# EAGLE design mb (EAGLE 9.5.2)

## Sheet 1 of 4: Controller
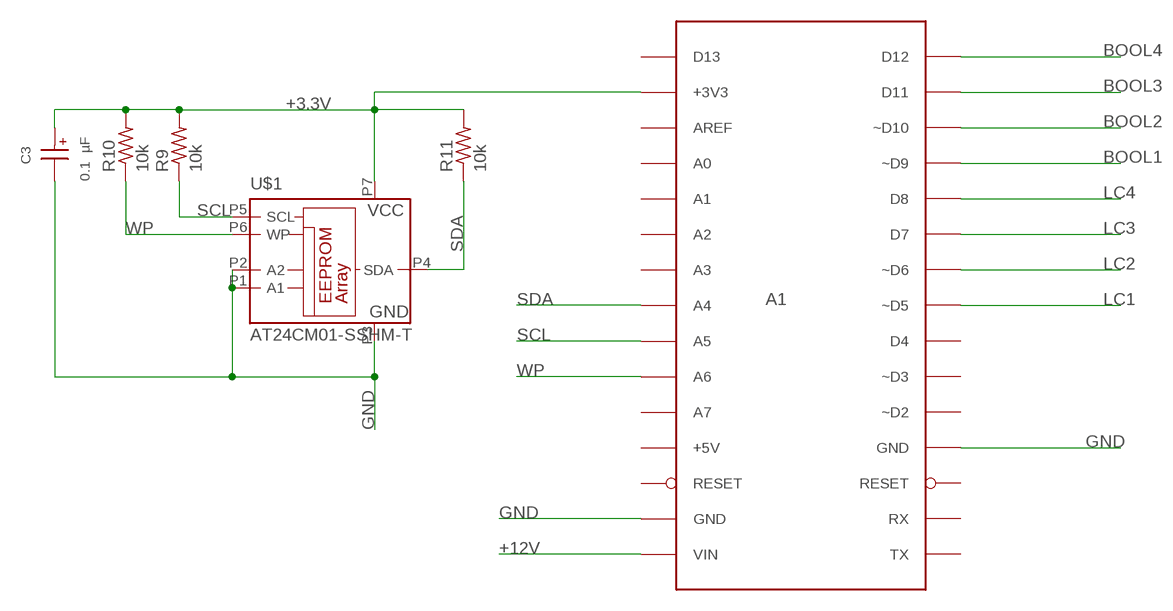
[diagram p0: schematic, sheet 1]

### Parts
A1  NANO_33_IOTNANO_EVERY_SMD  [NANO_EVERY_SMD_PADS]
C3  0.1 µF  WCAP-ATG5_5X11_860020672001  [WCAP-ATG5_5X11(DXL)]
R9  10k  YAGEO-CFR-25  [CFR-25]
R10  10k  YAGEO-CFR-25  [CFR-25]
R11  10k  YAGEO-CFR-25  [CFR-25]
U$1  AT24CM01-SSHM-T  [8-SOIC(3.9MM)]

### Nets
+3.3V: A1.+3.3V(+3V3) C3.1(+) R9.P$2 R10.P$2 R11.P$2 U$1.P7(VCC) ; also sheet 3,4
+12V [POWER]: A1.VIN ; also sheet 2,4
BOOL1: A1.D9(~D9) ; also sheet 4
BOOL2: A1.D10(~D10) ; also sheet 4
BOOL3: A1.D11 ; also sheet 4
BOOL4: A1.D12 ; also sheet 4
GND: A1.GND@1(GND) A1.GND@2(GND) C3.2(-) U$1.P1(A1) U$1.P2(A2) U$1.P3(GND) ; also sheet 2,4
LC1: A1.D5(~D5) ; also sheet 3
LC2: A1.D6(~D6) ; also sheet 3
LC3: A1.D7 ; also sheet 3
LC4: A1.D8 ; also sheet 3
SCL: A1.A5 R9.P$1 U$1.P5(SCL) ; also sheet 4
SDA: A1.A4 R11.P$1 U$1.P4(SDA) ; also sheet 4
WP: A1.A6 R10.P$1 U$1.P6(WP)
Unconnected: A1.+5V A1.A0 A1.A1 A1.A2 A1.A3 A1.A7 A1.AREF A1.D2(~D2) A1.D3(~D3) A1.D4 A1.D13 A1.RESET@1(RESET) A1.RESET@2(RESET) A1.RX A1.TX

## Sheet 2 of 4: Power
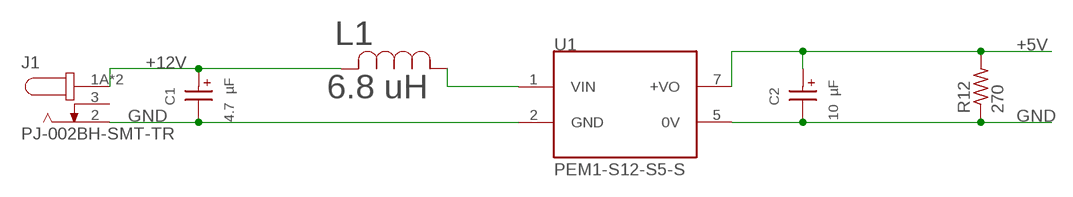
[diagram p1: schematic, sheet 2]

### Parts
C1  4.7 µF  WCAP-ATG5_5X11_860020672008  [WCAP-ATG5_5X11(DXL)]
C2  10 µF  WCAP-ATG5_5X11_860020672010  [WCAP-ATG5_5X11(DXL)]
J1  PJ-002BH-SMT-TR  [CUI_PJ-002BH-SMT-TR]
L1  6.8 uH  RL622-6R8K-RC  [RL622_SERIES]
R12  270  YAGEO-CFR-25  [CFR-25]
U1  PEM1-S12-S5-S  [CONV_PEM1-S12-S5-S]

### Nets
+5V: C2.1(+) R12.P$2 U1.7(+VO) ; also sheet 3
+12V [POWER]: C1.1(+) J1.1A J1.1B L1.2 ; also sheet 1,4
GND: C1.2(-) C2.2(-) J1.2 R12.P$1 U1.2(GND) U1.5(0V) ; also sheet 1,4
N$1: L1.1 U1.1(VIN)
Unconnected: J1.3

## Sheet 3 of 4: Level Shifter
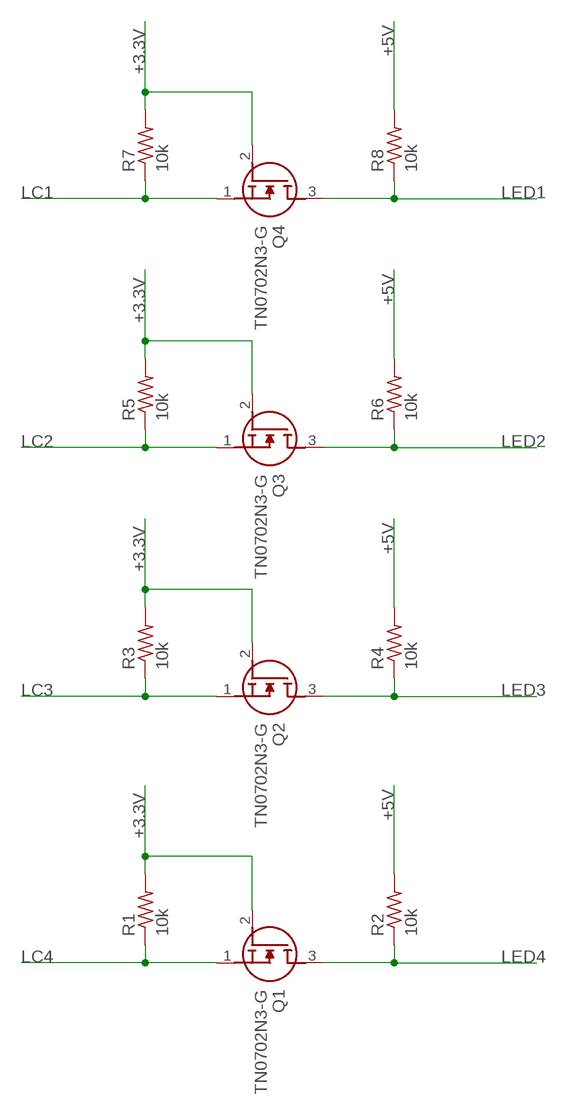
[diagram p2: schematic, sheet 3]

### Parts
Q1  TN0702N3-G  [LND150N3-G]
Q2  TN0702N3-G  [LND150N3-G]
Q3  TN0702N3-G  [LND150N3-G]
Q4  TN0702N3-G  [LND150N3-G]
R1  10k  YAGEO-CFR-25  [CFR-25]
R2  10k  YAGEO-CFR-25  [CFR-25]
R3  10k  YAGEO-CFR-25  [CFR-25]
R4  10k  YAGEO-CFR-25  [CFR-25]
R5  10k  YAGEO-CFR-25  [CFR-25]
R6  10k  YAGEO-CFR-25  [CFR-25]
R7  10k  YAGEO-CFR-25  [CFR-25]
R8  10k  YAGEO-CFR-25  [CFR-25]

### Nets
+3.3V: Q1.2(G) Q2.2(G) Q3.2(G) Q4.2(G) R1.P$2 R3.P$2 R5.P$2 R7.P$2 ; also sheet 1,4
+5V: R2.P$2 R4.P$2 R6.P$2 R8.P$2 ; also sheet 2
LC1: Q4.1(S) R7.P$1 ; also sheet 1
LC2: Q3.1(S) R5.P$1 ; also sheet 1
LC3: Q2.1(S) R3.P$1 ; also sheet 1
LC4: Q1.1(S) R1.P$1 ; also sheet 1
LED1: Q4.3(D) R8.P$1 ; also sheet 4
LED2: Q3.3(D) R6.P$1 ; also sheet 4
LED3: Q2.3(D) R4.P$1 ; also sheet 4
LED4: Q1.3(D) R2.P$1 ; also sheet 4

## Sheet 4 of 4: Connectors
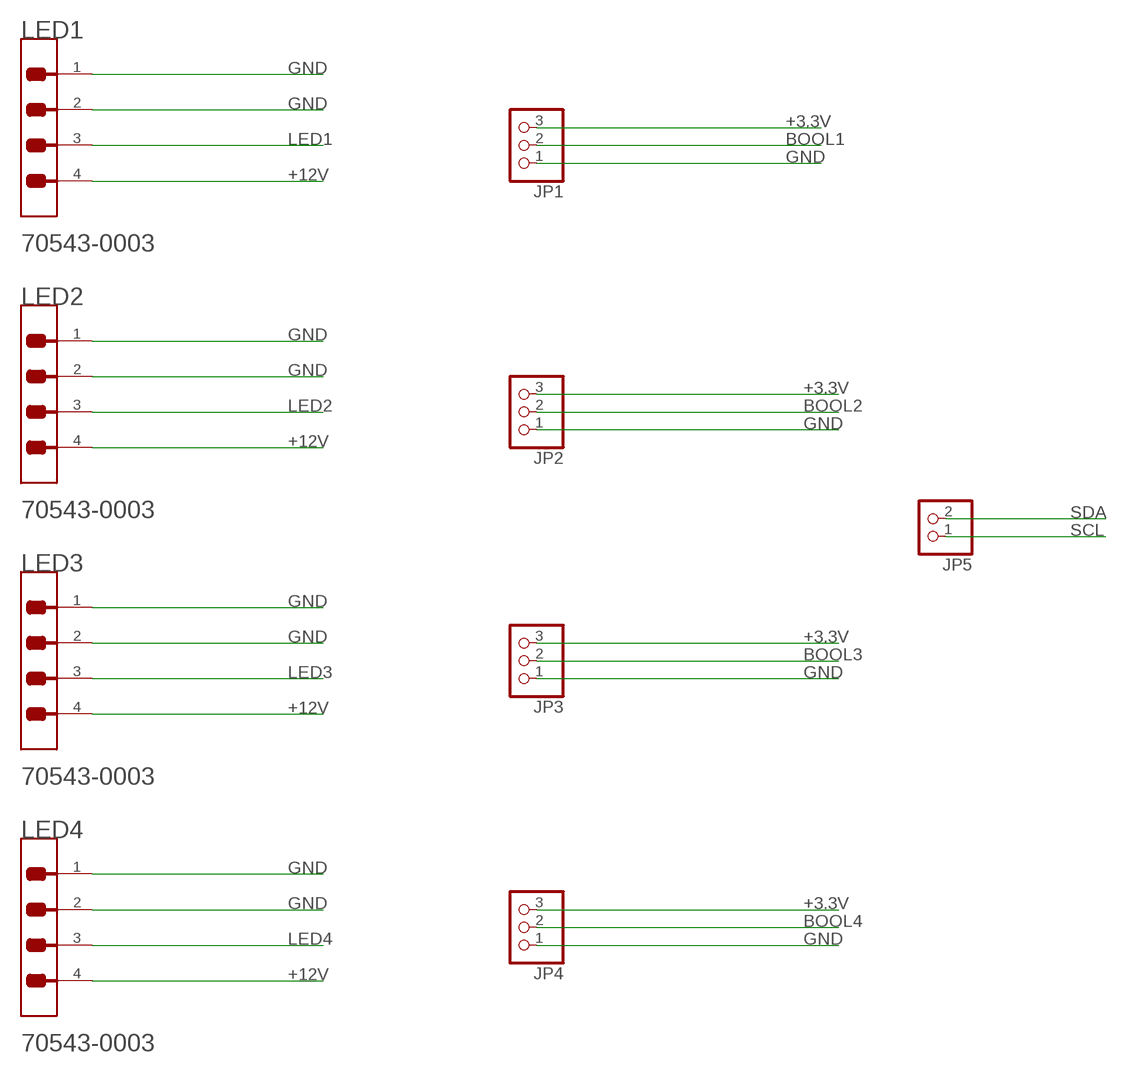
[diagram p3: schematic, sheet 4]

### Parts
JP1  PINHD-1X3/90  [1X03/90]
JP2  PINHD-1X3/90  [1X03/90]
JP3  PINHD-1X3/90  [1X03/90]
JP4  PINHD-1X3/90  [1X03/90]
JP5  PINHD-1X2  [1X02]
LED1  MOLEX_70543-0003MOLEX_70543-0003_0_0  [MOLEX_70543-0003_0]
LED2  MOLEX_70543-0003MOLEX_70543-0003_0_0  [MOLEX_70543-0003_0]
LED3  MOLEX_70543-0003MOLEX_70543-0003_0_0  [MOLEX_70543-0003_0]
LED4  MOLEX_70543-0003MOLEX_70543-0003_0_0  [MOLEX_70543-0003_0]

### Nets
+3.3V: JP1.3 JP2.3 JP3.3 JP4.3 ; also sheet 1,3
+12V [POWER]: LED1.4 LED2.4 LED3.4 LED4.4 ; also sheet 1,2
BOOL1: JP1.2 ; also sheet 1
BOOL2: JP2.2 ; also sheet 1
BOOL3: JP3.2 ; also sheet 1
BOOL4: JP4.2 ; also sheet 1
GND: JP1.1 JP2.1 JP3.1 JP4.1 LED1.1 LED1.2 LED2.1 LED2.2 LED3.1 LED3.2 LED4.1 LED4.2 ; also sheet 1,2
LED1: LED1.3 ; also sheet 3
LED2: LED2.3 ; also sheet 3
LED3: LED3.3 ; also sheet 3
LED4: LED4.3 ; also sheet 3
SCL: JP5.1 ; also sheet 1
SDA: JP5.2 ; also sheet 1

## Library data of the parts
A1 = Arduino:NANO_33_IOT: Nano 33 IOT board
C1 = 860020672008_Eagle_WCAP-ATG5_rev20a:WCAP-ATG5_5X11: WCAP-ATG5 Aluminium Electrolytic Capacitors General Purpose +105 °C Characteristics General purpose product series with max. operating temperature of +105 °C Mounting style: THT Radial Capacitance range: 0.1 µF ‒ 18000 µF Capacitance tolerance: ±20 % Operating temperature: -40 °C up to +105 °C for UR < 400 V(DC) -25 °C up to +105 °C for UR ≥ 400 V(DC) Endurance: 2000 h @ +105 °C Dimensions (DxL) in mm: 5.0 x 11.0 up to 22.0 x 31.0 Recommended soldering: Wave soldering Applications Filtering Smoothing Energy storage Coupling e.g. Switched-mode power supply, AC/DC converter, adapter, charger, digital camera <https://www.we-online.com/catalog/media/o35284v209%20WCAP-ATG5_4C.jpg> Details see: https://www.we-online.com/catalog/en/WCAP-ATG5/ Updated by yingchun,Shan;2020-02-28 2020(C) Würth Elektronik; DATASHEET-URL: https://www.we-online.com/catalog/datasheet/860020672008.pdf; DF: 10%; DIAMETER: 5mm; I-LEAK: 3uA; I-RIPPLE: 32mA; L: 11mm; OPERATING-TEMPERATURE: -40 °C up to +105 °C; PART-NUMBER: 860020672008; PITCH: 2mm; TECHNICAL-REFERENCE: ATDC1104R7M050DSPA3B000; VR: 50V(DC)
C2 = 860020672008_Eagle_WCAP-ATG5_rev20a:WCAP-ATG5_5X11: WCAP-ATG5 Aluminium Electrolytic Capacitors General Purpose +105 °C Characteristics General purpose product series with max. operating temperature of +105 °C Mounting style: THT Radial Capacitance range: 0.1 µF ‒ 18000 µF Capacitance tolerance: ±20 % Operating temperature: -40 °C up to +105 °C for UR < 400 V(DC) -25 °C up to +105 °C for UR ≥ 400 V(DC) Endurance: 2000 h @ +105 °C Dimensions (DxL) in mm: 5.0 x 11.0 up to 22.0 x 31.0 Recommended soldering: Wave soldering Applications Filtering Smoothing Energy storage Coupling e.g. Switched-mode power supply, AC/DC converter, adapter, charger, digital camera <https://www.we-online.com/catalog/media/o35284v209%20WCAP-ATG5_4C.jpg> Details see: https://www.we-online.com/catalog/en/WCAP-ATG5/ Updated by yingchun,Shan;2020-02-28 2020(C) Würth Elektronik; DATASHEET-URL: https://www.we-online.com/catalog/datasheet/860020672010.pdf; DF: 10%; DIAMETER: 5mm; I-LEAK: 5uA; I-RIPPLE: 48mA; L: 11mm; OPERATING-TEMPERATURE: -40 °C up to +105 °C; PART-NUMBER: 860020672010; PITCH: 2mm; TECHNICAL-REFERENCE: ATDC110100M050DSPA3B000; VR: 50V(DC)
C3 = 860020672008_Eagle_WCAP-ATG5_rev20a:WCAP-ATG5_5X11: WCAP-ATG5 Aluminium Electrolytic Capacitors General Purpose +105 °C Characteristics General purpose product series with max. operating temperature of +105 °C Mounting style: THT Radial Capacitance range: 0.1 µF ‒ 18000 µF Capacitance tolerance: ±20 % Operating temperature: -40 °C up to +105 °C for UR < 400 V(DC) -25 °C up to +105 °C for UR ≥ 400 V(DC) Endurance: 2000 h @ +105 °C Dimensions (DxL) in mm: 5.0 x 11.0 up to 22.0 x 31.0 Recommended soldering: Wave soldering Applications Filtering Smoothing Energy storage Coupling e.g. Switched-mode power supply, AC/DC converter, adapter, charger, digital camera <https://www.we-online.com/catalog/media/o35284v209%20WCAP-ATG5_4C.jpg> Details see: https://www.we-online.com/catalog/en/WCAP-ATG5/ Updated by yingchun,Shan;2020-02-28 2020(C) Würth Elektronik; DATASHEET-URL: https://www.we-online.com/catalog/datasheet/860020672001.pdf; DF: 10%; DIAMETER: 5mm; I-LEAK: 3uA; I-RIPPLE: 1.3mA; L: 11mm; OPERATING-TEMPERATURE: -40 °C up to +105 °C; PART-NUMBER: 860020672001; PITCH: 2mm; TECHNICAL-REFERENCE: ATDC110R10M050DSPA3B000; VR: 50V(DC)
J1 = ref_lib:PJ-002BH-SMT-TR: 2.5 mm Center Pin, 5.0 A, Right Angle, Surface Mount (SMT), Dc Power Jack Connector; MANUFACTURER: CUI INC; STANDARD: Manufacturer recommendations
JP1-JP4 = pinhead:PINHD-1X3: PIN HEADER
JP5 = pinhead:PINHD-1X2: PIN HEADER
L1 = ref_lib:RL622-6R8K-RC; BUILT_BY: EMA_UL_Team; MANUFACTURER_PART_NUMBER: RL622-4R7K-RC; SOURCELIBRARY: Bourns_2012-01-12_RL622; VENDOR: Bourns Electronics
LED1-LED4 = Molex - 70543-0003:MOLEX_70543-0003: 4 Positions Header Connector 0.100" (2.54mm) Through Hole Gold; CENTROID_NOT_SPECIFIED: No; DATASHEET: http://www.molex.com/pdm_docs/sd/705430001_sd.pdf; DIGIKEY_DESCRIPTION: CONN HEADER 4POS .100 VERT GOLD; DIGIKEY_PART_NUMBER: WM4802-ND; LEAD_FREE: yes; MF: Molex; MOUSER_PART_NUMBER: 538-70543-0003; MPN: 70543-0003; PACKAGE: HDR4; PREFIX: J; ROHS: yes; TEMPERATURE_RANGE_HIGH: +105°C; TEMPERATURE_RANGE_LOW: -40°C
Q1-Q4 = SamacSys_Parts:TN0702N3-G: MOSFET 20V 1.3Ohm Source: Datasheet <https://www.arrow.com/en/products/tn0702n3-g/microchip-technology>; DESCRIPTION: MOSFET 20V 1.3Ohm; HEIGHT: mm; MANUFACTURER_NAME: Microchip; MANUFACTURER_PART_NUMBER: TN0702N3-G; MOUSER_PART_NUMBER: 689-TN0702N3-G; MOUSER_PRICE-STOCK: https://www.mouser.co.uk/ProductDetail/Microchip-Technology/TN0702N3-G?qs=b1HjDA41YmFb%2FZmSTijIVQ%3D%3D
R1-R12 = ref_lib:YAGEO-CFR-25
U1 = ref_lib:PEM1-S12-S5-S: 12 Vdc, 0.083 A, 1 W, 10.8~13.2 Vdc Input Range; AVAILABILITY: Good; DESCRIPTION: PEM1 Series 1 W 12 VDC 83 mA Single Output DC-DC Isolated Converter; MF: CUI; MP: PEM1-S12-S12-S; PACKAGE: SIP-7 CUI; PRICE: 4.53 USD
U$1 = ref_lib:AT24CM01-SSHM-T

## Net classes
1 POWER: width 1.524 mm

## Board
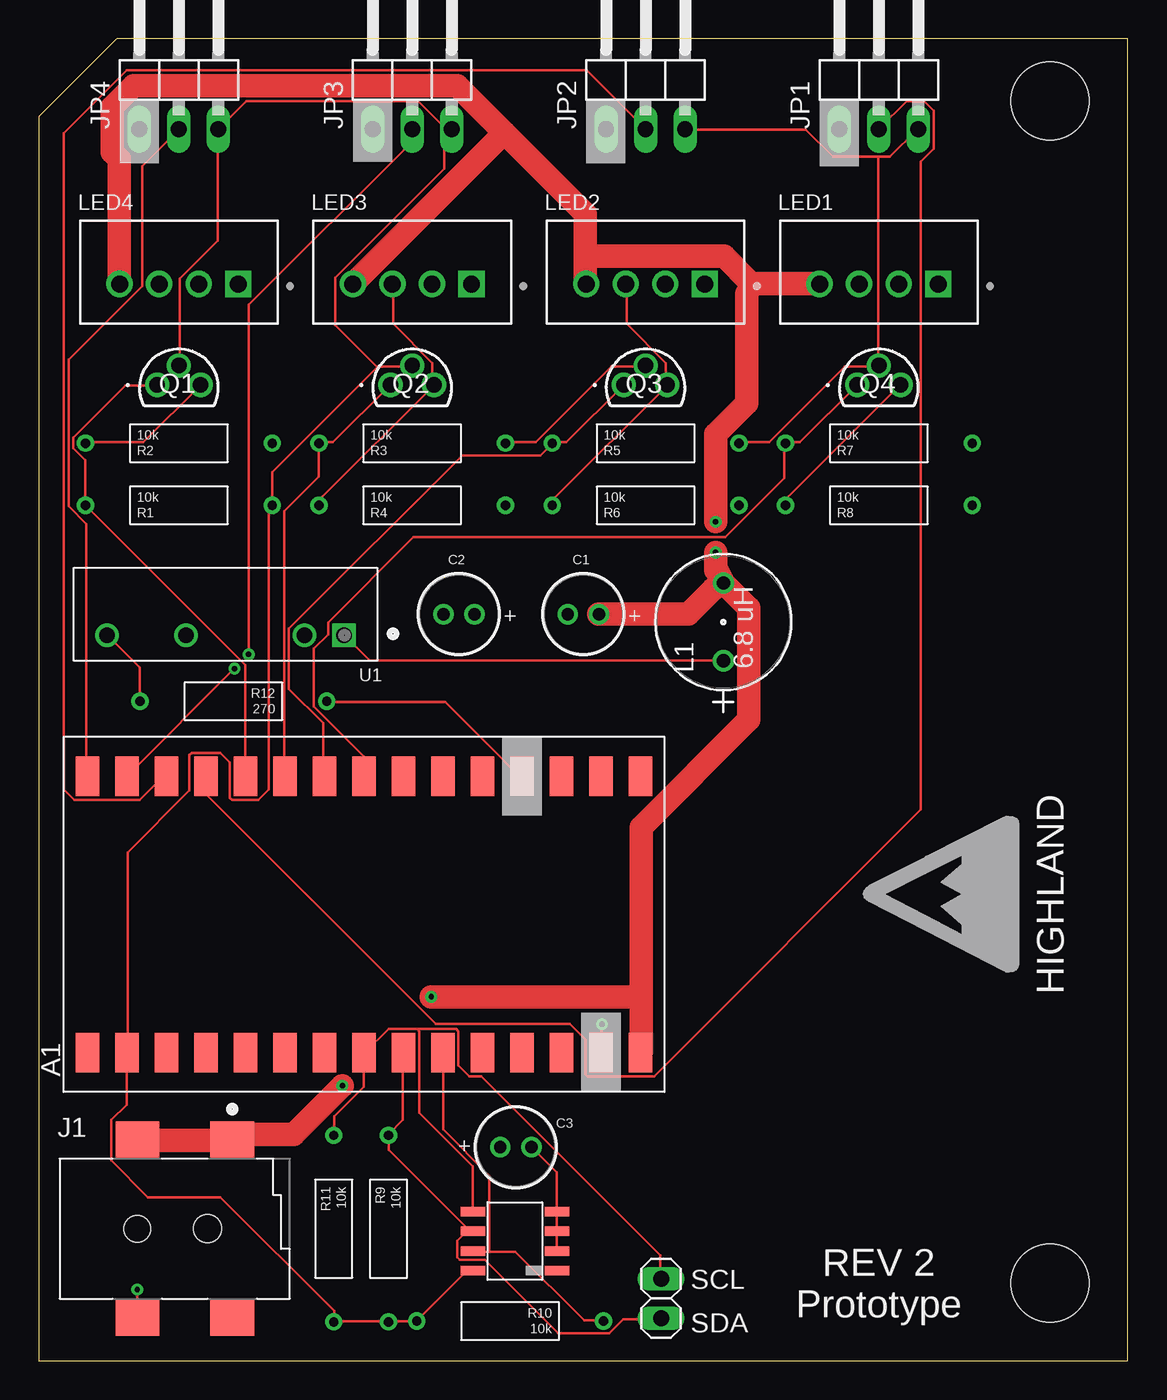
[diagram p4: board, top side]
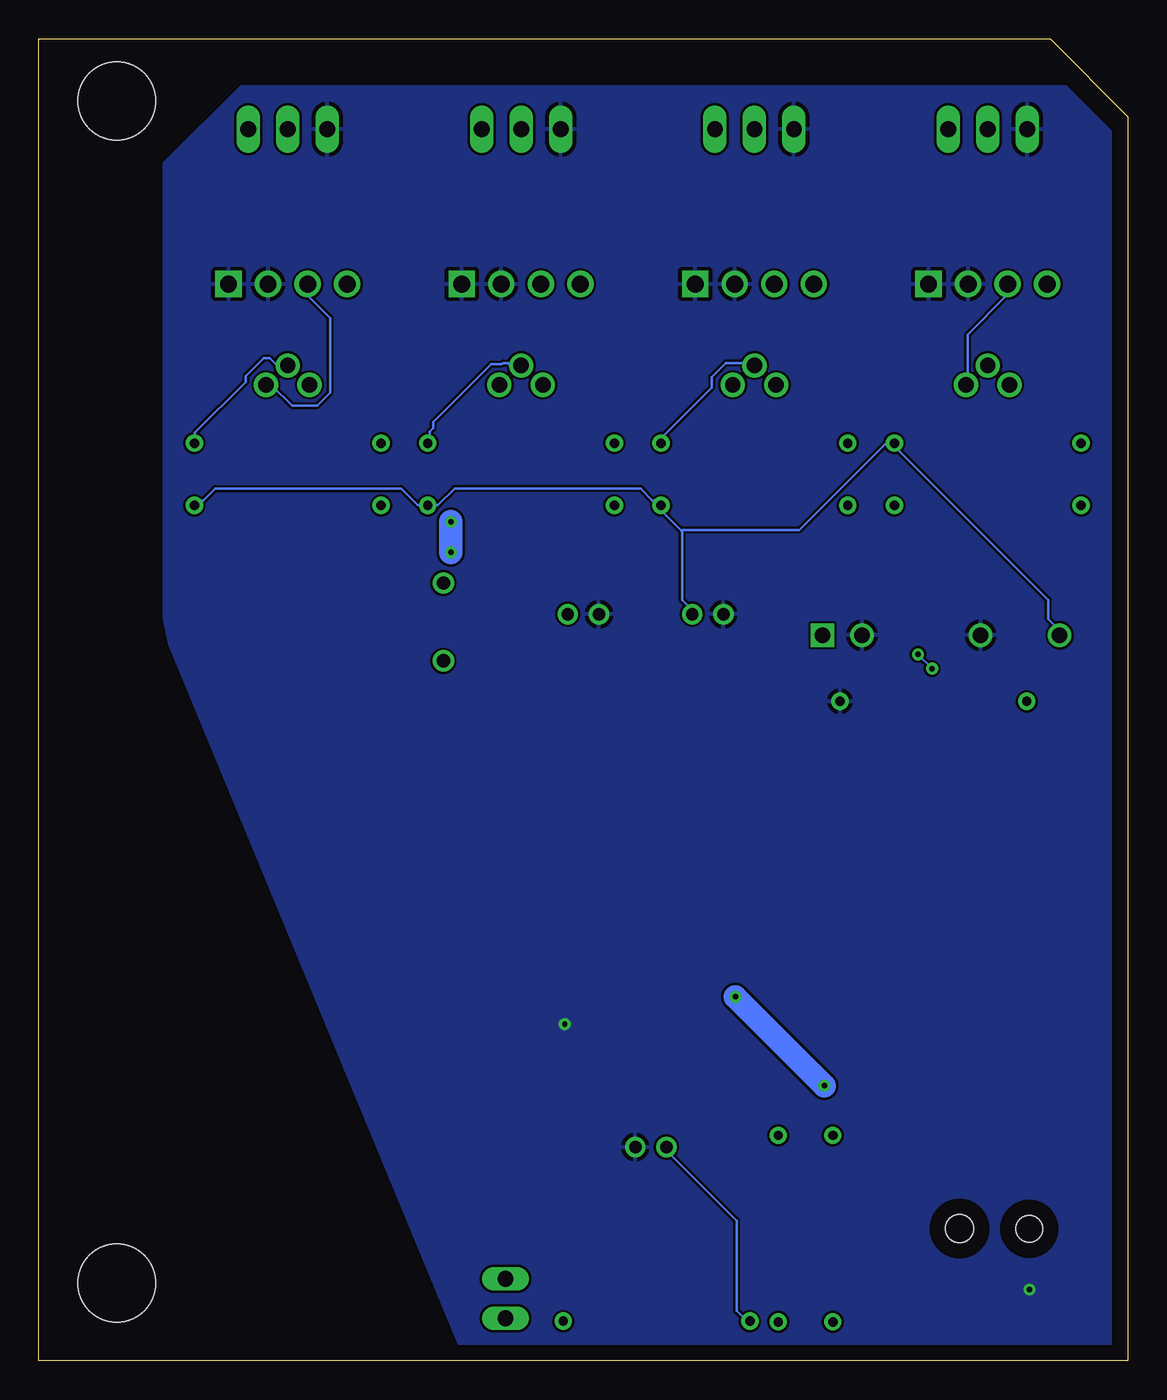
[diagram p5: board, bottom side, seen from below]

Size 70 x 85 mm. Coordinates in mm from the lower left corner, seen from the top.
Outline: 0,0 70,0 70,85 5,85 0,80 0,0
Copper layers (1*16): Top 0.035mm / dielectric 1.5mm / Bottom 0.035mm
Design rules "default": minimum track width 6mil, minimum drill 0.35mm, track to track 6mil, track to pad 6mil, pad to pad 6mil, via to via 6mil, smd to smd 6mil, copper to edge 40mil, drill to drill 6mil, minimum pad ring 10mil, minimum via ring 8mil, stop-mask expansion 4mil, vias tented up to drill 0mil, thermal gap 10mil
Holes 5 mm at 65,5 65,81

### Footprints (pad centres in the part's own frame; a part is rotated, then mirrored left to right if it is on the bottom)
NANO_EVERY_SMD_PADS = smd 2.54 x 1.524: +3.3V 0,-2.54; +5V 0,-27.94; A0 0,-7.62; A1 0,-10.16; A2 0,-12.7; A3 0,-15.24; A4 0,-17.78; A5 0,-20.32; A6 0,-22.86; A7 0,-25.4; AREF 0,-5.08; D2 17.78,-25.4; D3 17.78,-22.86; D4 17.78,-20.32; D5 17.78,-17.78; D6 17.78,-15.24; D7 17.78,-12.7; D8 17.78,-10.16; D9 17.78,-7.62; D10 17.78,-5.08; D11 17.78,-2.54; D12 17.78,0; D13 0,0; GND@1 0,-33.02; GND@2 17.78,-27.94; RESET@1 0,-30.48; RESET@2 17.78,-30.48; RX 17.78,-33.02; TX 17.78,-35.56; VIN 0,-35.56
WCAP-ATG5_5X11(DXL) = drill 0.8: 1 1,0; 2 -1,0
CUI_PJ-002BH-SMT-TR = smd 2.8 x 2.4: 1A 0,0; 1B -6.1,0; 2 -6.1,-11.4; 3 0,-11.4 | hole 1.7: -6.1,-5.7 | hole 1.8: -1.6,-5.7
1X03/90 = drill 1.016 long: 1 -2.54,-3.81; 2 0,-3.81; 3 2.54,-3.81
1X02 = drill 1.016 long: 1 -1.27,0; 2 1.27,0
RL622_SERIES = drill 0.864 pad 1.372: 1 0,0; 2 5.004,0
MOLEX_70543-0003_0 = drill 1.09 pad 1.69 square: 1 3.81,-0.76 | drill 1.09 pad 1.69: 2 1.27,-0.76; 3 -1.27,-0.76; 4 -3.81,-0.76
LND150N3-G = drill 0.99 pad 1.55: 1 -1.397,-0.25; 2 0,1; 3 1.397,-0.25
CFR-25 = drill 0.6: P$1 -6,0; P$2 6,0
CONV_PEM1-S12-S5-S = drill 1 square: 1 -7.62,1.35 | drill 1: 2 -5.08,1.35; 5 2.54,1.35; 7 7.62,1.35
8-SOIC(3.9MM) = smd 1.55 x 0.6: P0 0,0; P1 0,-1.27; P2 0,-2.54; P3 0,-3.81; P4 5.4,-3.81; P5 5.4,-2.54; P6 5.4,-1.27; P7 5.4,0

### Placement (x,y rotation side)
A1  3.12,19.81 90 top
C1  35,48 0 top
C2  27,48 0 top
C3  30.66,13.73 180 top
J1  12.43,14.19 0 top
JP1  54,83 0 top
JP2  39,83 0 top
JP3  24,83 0 top
JP4  9,83 0 top
JP5  40,4 90 top
L1  44,45 90 top
LED1  54,70 0 top
LED2  39,70 0 top
LED3  24,70 0 top
LED4  9,70 0 top
Q1  9,63 0 top
Q2  24,63 0 top
Q3  39,63 0 top
Q4  54,63 0 top
R1  9,55 0 top
R2  9,59 0 top
R3  24,59 0 top
R4  24,55 0 top
R5  39,59 0 top
R6  39,55 0 top
R7  54,59 0 top
R8  54,55 0 top
R9  22.47,8.49 270 top
R10  30.29,2.54 180 top
R11  18.96,8.49 270 top
R12  12.5,42.4 180 top
U1  12,48 180 top
U$1  33.3,5.79 180 top

### Tracks (layer width: path | path; a pad name or v marks a point on that pad's centre or on a via)
+3.3V
  Top 0.152: U$1.P7 27.89,5.71 27.43,5.71 24.31,2.59 R10.P$2 24.23,2.52 22.48,2.52 R9.P$2 22.4,2.52 18.97,2.52 R11.P$2 18.97,2.59 18.97,3.2 11.66,10.52 7.01,10.52 4.65,12.88 4.65,15.47 5.64,16.46 5.64,19.74 A1.+3.3V 5.71,19.81 5.71,32.69 9.68,36.65 9.68,38.94 9.83,39.09 11.66,39.09 12.27,38.48 12.27,36.2 12.42,36.04 14.1,36.04 14.78,36.73 14.78,54.79 14.94,54.94 R1.P$2 15.01,55.02 15.01,57.15 21.75,63.89 | Q1.2 9.07,64.01 9.07,69.57 11.51,72.01 11.51,79.17 JP4.3 11.58,79.25 13.34,81 24.38,81 26.14,79.25 26.52,79.25 JP3.3 26.06,79.25 26.06,76.66 19.05,69.65 19.05,66.6 21.75,63.89 | R3.P$2 30.02,59.05 31.93,59.05 36.8,63.93 38.94,63.93 Q3.2 | 21.75,63.89 21.79,63.93 23.93,63.93 Q2.2 | 53.95,77.42 54.71,77.42 56.46,79.17 JP1.3 | 53.95,77.42 51.05,77.42 49.3,79.17 41.6,79.17 JP2.3 | R5.P$2 45.03,59.05 46.94,59.05 51.82,63.93 53.95,63.93 Q4.2 53.95,64.01 53.95,77.42
  Bottom 0.152: C3.1 29.64,13.72 29.64,13.49 25.15,8.99 25.15,3.2 24.54,2.59 24.31,2.59 R10.P$2 | R3.P$2 29.95,59.05 29.95,59.36 26.75,62.56 26.75,63.25 25.83,64.16 24.16,64.16 Q2.2 | R7.P$2 59.97,59.05 59.97,59.66 56.69,62.94 56.69,63.32 55.55,64.47 55.17,64.47 54.71,64.01 54.03,64.01 Q4.2 | Q3.2 39.01,64.01 39.7,64.01 39.85,64.16 40.16,64.16 40.23,64.08 40.92,64.08 44.65,60.35 44.65,59.97 44.88,59.74 44.88,59.13 44.96,59.05 R5.P$2
+5V
  Top 0.152: R12.P$2 6.48,42.44 6.48,44.58 4.42,46.63 U1.7
  Bottom 0.152: R8.P$2 59.97,55.02 59.82,55.02 59.51,55.32 59.44,55.32 58.67,56.08 46.71,56.08 45.64,55.02 45.03,55.02 R6.P$2 44.96,55.02 44.35,55.02 43.28,56.08 31.32,56.08 30.56,55.32 30.48,55.32 30.18,55.02 30.02,55.02 R4.P$2 29.95,54.94 29.95,54.63 28.69,53.38 | 28.69,53.38 28.65,53.34 28.65,48.92 28.04,48.31 28.04,48.01 C2.1 | 14.94,58.9 14.94,58.75 5.11,48.92 5.11,47.7 4.42,47.02 4.42,46.71 U1.7 | 14.94,58.9 14.94,58.98 R2.P$2 14.94,58.9 | 14.94,58.9 15.62,58.9 21.11,53.42 28.65,53.42 28.69,53.38
+12V  (via drill 0.35)
  Top 1.524: 29.91,78.98 35.13,73.76 35.13,71.02 | 29.91,78.98 26.9,81.99 6.1,81.99 4.72,80.62 4.72,77.72 5.18,77.27 5.18,69.27 LED4.4 | 35.13,71.02 35.13,69.27 LED2.4 | 29.91,78.98 20.19,69.27 LED3.4 | 45.8,69.27 50.14,69.27 LED1.4 | 45.8,69.27 44.04,71.02 35.13,71.02 | J1.1B 6.4,14.17 12.42,14.17 J1.1A 13.11,14.55 16.38,14.55 v19.51,17.68 | 38.71,23.39 38.71,34.29 45.64,41.22 45.64,48.39 44.04,49.99 L1.2 | 38.71,23.39 38.71,19.81 A1.VIN | C1.1 36.04,48.01 41.76,48.01 43.36,49.61 L1.2 | 38.71,23.39 v25.22,23.39 | v43.51,53.95 43.51,59.59 45.49,61.57 45.49,68.58 45.8,69.27 | v43.51,51.97 43.51,50.83 43.66,50.67 L1.2
  Bottom 1.524: v25.22,23.39 v19.51,17.68 | v43.51,51.97 v43.51,53.95
BOOL1
  Top 0.152: A1.D9 10.74,37.57 10.74,36.42 25.53,21.64 34.14,21.64 35.13,20.65 35.13,18.44 35.28,18.29 39.55,18.29 56.69,35.43 56.69,77.11 57.53,77.95 57.53,80.39 56.92,81 55.78,81 54.03,79.25 JP1.2
BOOL2
  Top 0.152: A1.D10 8.15,37.57 8,37.57 6.48,36.04 2.29,36.04 1.6,36.73 1.6,78.94 5.64,82.98 35.2,82.98 38.94,79.25 JP2.2
BOOL3  (via drill 0.35)
  Top 0.152: v12.57,44.5 5.71,37.64 A1.D11 | v13.49,45.41 13.49,67.89 23.93,78.33 23.93,79.17 JP3.2
  Bottom 0.152: v13.49,45.41 v12.57,44.5
BOOL4
  Top 0.152: A1.D12 3.05,37.64 3.05,53.8 1.91,54.94 1.91,64.39 6.63,69.11 6.63,76.81 8.99,79.17 JP4.2
GND  (via drill 0.35)
  Top 0.152: U$1.P1 33.3,7.09 33.3,8.31 U$1.P2 33.3,8.38 33.3,9.53 U$1.P3 33.3,12.12 31.7,13.72 C3.2 | A1.GND@2 31.01,37.64 30.86,37.64 26.14,42.37 18.52,42.37 R12.P$1 | v36.2,21.64 36.2,19.81 A1.GND@1 | v6.33,4.57 6.33,2.82 J1.2
  pour Bottom (rank 3): 1,1 1,79 4,82 57,82 62,77 62,47.74 61.67,46.07 43,1
LC1
  Top 0.152: Q4.1 52.58,62.71 48.92,59.05 48.01,59.05 R7.P$1 47.93,58.98 47.93,56.77 44.12,52.96 24.08,52.96 18.59,47.47 18.59,46.71 17.68,45.8 17.68,42.06 20.88,38.86 20.88,37.64 A1.D5
LC2
  Top 0.152: Q3.1 37.57,62.71 33.91,59.05 33.07,59.05 R5.P$1 32.99,58.98 32.23,58.22 27.2,58.22 16.08,47.09 16.08,43.2 18.29,41 18.29,37.64 A1.D6
LC3
  Top 0.152: Q2.1 22.55,62.71 18.9,59.05 18.06,59.05 R3.P$1 17.98,58.98 17.98,56.84 15.77,54.63 15.77,37.64 A1.D7
LC4
  Top 0.152: Q1.1 7.54,62.71 5.56,62.71 2.21,59.36 2.21,58.67 2.97,57.91 2.97,55.02 R1.P$1 3.05,54.94 13.26,44.73 13.26,37.64 A1.D8
LED1
  Top 0.152: R8.P$1 48.01,55.02 48.01,55.4 55.32,62.71 Q4.3 55.32,62.79
  Bottom 0.152: LED1.3 52.65,69.19 52.65,68.43 51.28,67.06 51.28,62.26 52.12,61.42 53.72,61.42 55.02,62.71 55.32,62.71 Q4.3
LED2
  Top 0.152: R6.P$1 33.07,55.02 33.07,55.4 40.39,62.71 Q3.3 | 40.31,62.71 Q3.3 | LED2.3 37.8,69.19 37.8,66.67 40.31,64.16 40.31,62.79 Q3.3
LED3
  Top 0.152: R4.P$1 18.06,55.02 18.06,55.4 25.38,62.71 Q2.3 | 25.3,62.71 Q2.3 | LED3.3 22.78,69.19 22.78,66.67 25.3,64.16 25.3,62.79 Q2.3
LED4
  Top 0.152: R2.P$1 3.05,59.05 6.71,59.05 10.36,62.71 Q1.3 10.29,62.71
  Bottom 0.152: LED4.3 7.77,69.19 7.77,68.5 10.29,65.99 10.29,63.55 10.36,63.48 10.36,62.79 Q1.3
N$1
  Top 0.152: L1.1 43.97,45.03 21.26,45.03 19.66,46.63 U1.1
SCL
  Top 0.152: A1.A5 23.39,19.74 23.39,15.47 22.48,14.55 R9.P$1 22.48,14.48 22.48,13.56 27.66,8.38 27.89,8.38 U$1.P5 27.58,8.38 26.9,7.7 26.9,6.63 27.05,6.48 28.65,6.48 33.38,1.75 36.65,1.75 37.57,2.67 39.93,2.67 JP5.1
SDA
  Top 0.152: 24.35,21.3 24.31,21.34 22.48,21.34 20.95,19.81 A1.A4 20.88,19.74 20.88,17.6 18.97,15.7 18.97,14.55 R11.P$1 | 24.35,21.3 24.46,21.18 24.46,15.93 27.89,12.5 27.89,9.6 U$1.P4 | JP5.2 39.93,5.33 39.93,6.78 28.42,18.29 27.66,18.29 26.98,18.97 26.98,21.18 26.82,21.34 24.38,21.34 24.35,21.3
WP
  Top 0.152: 28.96,7.01 30.63,7.01 35.05,2.59 36.27,2.59 R10.P$1 | 28.96,7.01 27.96,7.01 U$1.P6 | 28.96,7.01 28.96,11.89 25.98,14.86 25.98,19.74 A1.A6

### Text on the board
tPlace: HIGHLAND | SCL | REV 2 / Prototype | SDA